# Altium schematic sheet 海关全向控制器数传转接板.SchDoc
size A4
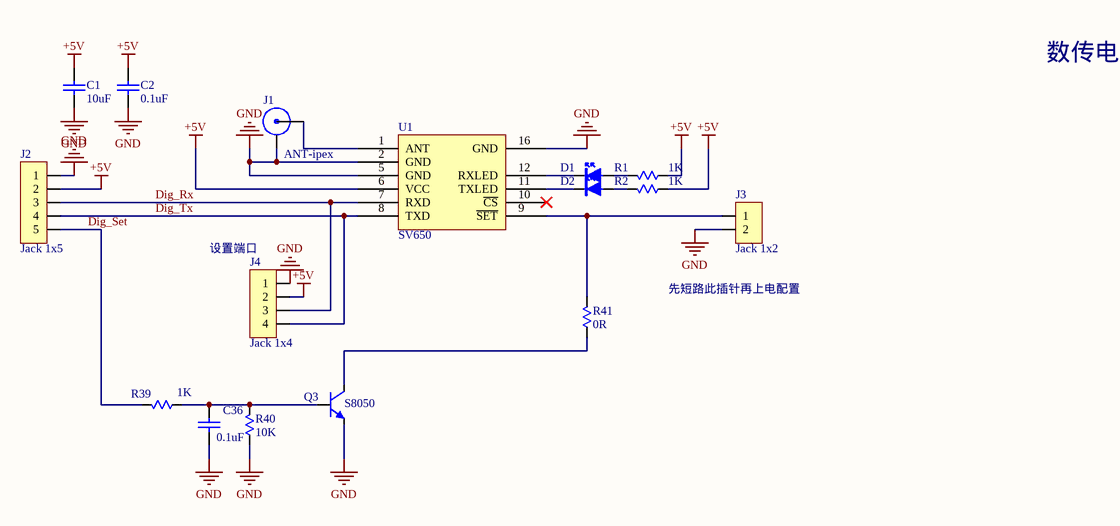
[diagram p0: 海关全向控制器数传转接板.SchDoc]

## Parts
C1  10uF  [C0603]
C2  0.1uF  [C0603]
C36  0.1uF  [C0603]
D1  LED  [LED0603]  (value not drawn)
D2  LED  [LED0603]  (value not drawn)
J1  ANT-ipex  [IPEX]
J2  Jack 1x5  [ZH-5AWD]
J3  Jack 1x2  [Jk1*2-2.0]
J4  Jack 1x4  [HDR1X4]
Q3  S8050  [SOT-23]
R1  1K  [R0603]
R2  1K  [R0603]
R39  1K  [R0603]
R40  10K  [R0603]
R41  0R  [R0603]
U1  SV650  [SV650]

## Nets
+5V: C1.2 C2.2 J2.2 J4.2 R1.1 R2.1 U1.6(VCC)
GND: C1.1 C2.1 C36.1 J1.2(GND) J2.1 J3.2 J4.1 Q3.2(E) R40.2 U1.2(GND) U1.5(GND) U1.16(GND)
Dig_Rx: J2.3 J4.3 U1.7(RXD)
Dig_Set: J2.5 R39.1
Dig_Tx: J2.4 J4.4 U1.8(TXD)
NetC36_2: C36.2 Q3.1(B) R39.2 R40.1
NetD1_1: D1.1(A) R1.2
NetD1_2: D1.2(K) U1.12(RXLED)
NetD2_1: D2.1(A) R2.2
NetD2_2: D2.2(K) U1.11(TXLED)
NetJ1_1: J1.1(ANT) U1.1(ANT)
NetJ3_1: J3.1 R41.1 U1.9(~{SET})
NetQ3_3: Q3.3(C) R41.2

Not connected (* = marked no-connect by the designer): U1 10(~{CS})*

## Notes on the sheet
- 数传电路
- (near J4) 设置端口
- 先短路此插针再上电配置

## Library data of the parts
C1 C2 = Cap Semi
C36 = CAP: Published: 8-Jun-2000; LatestRevisionDate: 17-Jul-2002; LatestRevisionNote: Re-released for DXP Platform.; PackageReference: RAD-0.3; Publisher: Altium Limited; Value: 0.1uF
J2 = Jack 1x5: 插座
J3 = Jack 1x2: 插座
J4 = Jack 1x4: 插座
Q3 = NPN: NPN General Purpose Amplifier; Published: 8-Jun-2000; LatestRevisionDate: 15-Jan-2003; LatestRevisionNote: PCB Footprint 'BCY-W3/D4.7' replaced; DatasheetDocument: 1997; PackageDocument: Sep-1998; PackageReference: TO-92A; Publisher: Altium Limited; Code_JEDEC: TO-92A; ComponentLink1Description: Manufacturer Link; ComponentLink1URL: http://www.fairchildsemi.com/; ComponentLink2Description: Datasheet; ComponentLink2URL: http://www.fairchildsemi.com/ds/2N%2F2N3904.pdf
R1 R2 R39-R41 = Res: Resistor; Published: 8-Jun-2000; LatestRevisionDate: 04-Mar-2005; LatestRevisionNote: PCB Footprint replaced.; PackageReference: J1-0603; Publisher: Altium Limited
  R39: Value: 1K
  R40: Value: 10K
  R41: Value: 0R